# EAGLE design D-class (EAGLE 9.5.2)
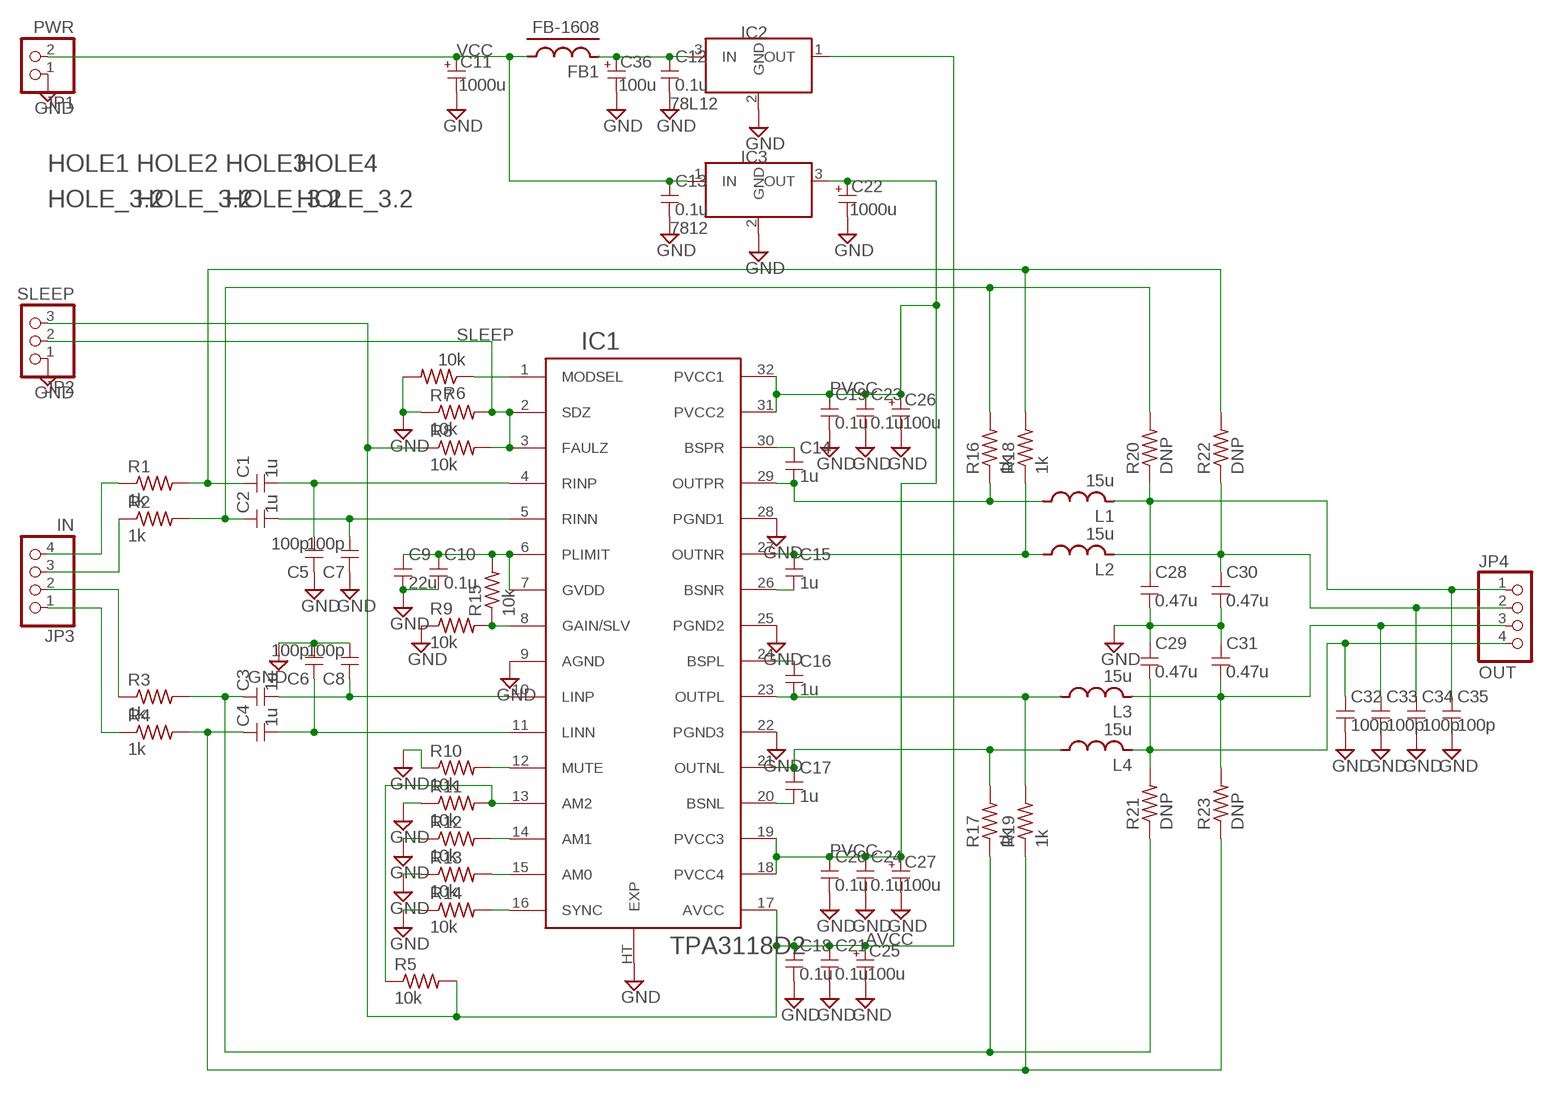
[diagram p0: schematic, sheet 1]

## Parts
C1  1u  C-3216  [3216]
C2  1u  C-3216  [3216]
C3  1u  C-3216  [3216]
C4  1u  C-3216  [3216]
C5  100p  C-1608  [1608]
C6  100p  C-1608  [1608]
C7  100p  C-1608  [1608]
C8  100p  C-1608  [1608]
C9  22u  C-2012  [2012]
C10  0.1u  C-1608  [1608]
C11  1000u  CPOLE5-10  [E5-10]
C12  0.1u  C-1608  [1608]
C13  0.1u  C-1608  [1608]
C14  1u  C-1608  [1608]
C15  1u  C-1608  [1608]
C16  1u  C-1608  [1608]
C17  1u  C-1608  [1608]
C18  0.1u  C-1608  [1608]
C19  0.1u  C-1608  [1608]
C20  0.1u  C-1608  [1608]
C21  0.1u  C-2012  [2012]
C22  1000u  CPOLE5-10  [E5-10]
C23  0.1u  C-2012  [2012]
C24  0.1u  C-2012  [2012]
C25  100u  CPOLE2.5-6.5  [E2.5-6.5]
C26  100u  CPOLE2.5-6.5  [E2.5-6.5]
C27  100u  CPOLE2.5-6.5  [E2.5-6.5]
C28  0.47u  C-5  [C050-030X075]
C29  0.47u  C-5  [C050-030X075]
C30  0.47u  C-5  [C050-030X075]
C31  0.47u  C-5  [C050-030X075]
C32  100p  C-1608  [1608]
C33  100p  C-1608  [1608]
C34  100p  C-1608  [1608]
C35  100p  C-1608  [1608]
C36  100u  CPOLE2.5-6.5  [E2.5-6.5]
FB1  FB-1608  [1608]
HOLE1  HOLE_3.2  [HOLE_3.2]
HOLE2  HOLE_3.2  [HOLE_3.2]
HOLE3  HOLE_3.2  [HOLE_3.2]
HOLE4  HOLE_3.2  [HOLE_3.2]
IC1  TPA3118D2  [HTSSOP32DAP]
IC2  78L12  78LX  [TO-92]
IC3  7812  78X-2  [TO-220]
JP1  PWR  PINHD-1X2  [1X02]
JP2  SLEEP  PINHD-1X3  [1X03]
JP3  IN  PINHD-1X4  [1X04]
JP4  OUT  PINHD-1X4  [1X04]
L1  15u  L-5  [L5-7,5]
L2  15u  L-5  [L5-7,5]
L3  15u  L-5  [L5-7,5]
L4  15u  L-5  [L5-7,5]
R1  1k  R-2.5  [0207/2V]
R2  1k  R-2.5  [0207/2V]
R3  1k  R-2.5  [0207/2V]
R4  1k  R-2.5  [0207/2V]
R5  10k  R-1608  [1608]
R6  10k  R-1608  [1608]
R7  10k  R-1608  [1608]
R8  10k  R-1608  [1608]
R9  10k  R-1608  [1608]
R10  10k  R-1608  [1608]
R11  10k  R-1608  [1608]
R12  10k  R-1608  [1608]
R13  10k  R-1608  [1608]
R14  10k  R-1608  [1608]
R15  10k  R-1608  [1608]
R16  1k  R-2.5  [0207/2V]
R17  1k  R-2.5  [0207/2V]
R18  1k  R-2.5  [0207/2V]
R19  1k  R-2.5  [0207/2V]
R20  DNP  R-2.5  [0207/2V]
R21  DNP  R-2.5  [0207/2V]
R22  DNP  R-2.5  [0207/2V]
R23  DNP  R-2.5  [0207/2V]

## Nets
AVCC: C18.1 C21.1 C25.+ IC1.17(AVCC) IC2.1(OUT) JP2.3 R5.2 R8.1
GND: C5.1 C6.2 C7.1 C8.2 C9.2 C10.2 C11.- C12.2 C13.2 C18.2 C19.2 C20.2 C21.2 C22.- C23.2 C24.2 C25.- C26.- C27.- C28.2 C29.1 C30.2 C31.1 C32.2 C33.2 C34.2 C35.2 C36.- IC1.9(AGND) IC1.22(PGND3) IC1.25(PGND2) IC1.28(PGND1) IC1.HT(EXP) IC2.2(GND) IC3.2(GND) JP1.1 JP2.1 R6.2 R7.1 R9.1 R10.1 R11.1 R12.1 R13.1 R14.1
N$1: C2.2 C7.2 IC1.5(RINN)
N$2: IC1.13(AM2) R5.1 R11.2
N$3: IC1.14(AM1) R12.2
N$4: IC1.15(AM0) R13.2
N$5: IC1.16(SYNC) R14.2
N$7: C12.1 C36.+ FB1.2 IC2.3(IN)
N$8: C17.2 IC1.20(BSNL)
N$9: C17.1 IC1.21(OUTNL) L4.P$1 R17.2
N$10: C16.2 IC1.23(OUTPL) L3.P$1 R19.2
N$11: C16.1 IC1.24(BSPL)
N$12: C15.2 IC1.26(BSNR)
N$13: C15.1 IC1.27(OUTNR) L2.P$1 R18.1
N$14: C14.2 IC1.29(OUTPR) L1.P$1 R16.1
N$15: C14.1 IC1.30(BSPR)
N$18: C3.2 C8.1 IC1.10(LINP)
N$19: C9.1 C10.1 IC1.6(PLIMIT) IC1.7(GVDD) R15.2
N$20: IC1.8(GAIN/SLV) R9.2 R15.1
N$21: C3.1 R3.2 R17.1 R21.1
N$22: C4.1 R4.2 R19.1 R23.1
N$23: C1.1 R1.2 R18.2 R22.2
N$24: C2.1 R2.2 R16.2 R20.2
N$25: C31.2 C33.1 JP4.3 L3.P$2 R23.2
N$26: C29.2 C32.1 JP4.4 L4.P$2 R21.2
N$27: C30.1 C34.1 JP4.2 L2.P$2 R22.1
N$28: C28.1 C35.1 JP4.1 L1.P$2 R20.1
N$29: JP3.2 R3.1
N$30: JP3.1 R4.1
N$31: JP3.3 R2.1
N$32: JP3.4 R1.1
N$36: IC1.1(MODSEL) R6.1
N$37: IC1.12(MUTE) R10.2
N$38: C1.2 C5.2 IC1.4(RINP)
N$39: C4.2 C6.1 IC1.11(LINN)
PVCC: C19.1 C20.1 C22.+ C23.1 C24.1 C26.+ C27.+ IC1.18(PVCC4) IC1.19(PVCC3) IC1.31(PVCC2) IC1.32(PVCC1) IC3.3(OUT)
SLEEP: IC1.2(SDZ) IC1.3(FAULZ) JP2.2 R7.2 R8.2
VCC: C11.+ C13.1 FB1.1 IC3.1(IN) JP1.2

## Library data of the parts
C1-C10 C12-C21 C23 C24 C28-C35 = my_rcl:C
C11 C22 C25-C27 C36 = my_rcl:CPOL
FB1 = my_rcl:FB
HOLE1-HOLE4 = Document_Robotech:HOLE_3.2: Robotech hole diameter 3.2mm tDoc washer(diameter 8mm) bDoc spacer(diameter 6mm)
IC1 = my_ic:TPA3118D2
IC2 = my_ic:78LX
IC3 = my_ic:78X
JP1 = pinhead:PINHD-1X2: PIN HEADER
JP2 = pinhead:PINHD-1X3: PIN HEADER
JP3 JP4 = pinhead:PINHD-1X4: PIN HEADER
L1-L4 = my_rcl:L
R1-R23 = my_rcl:R

## Board
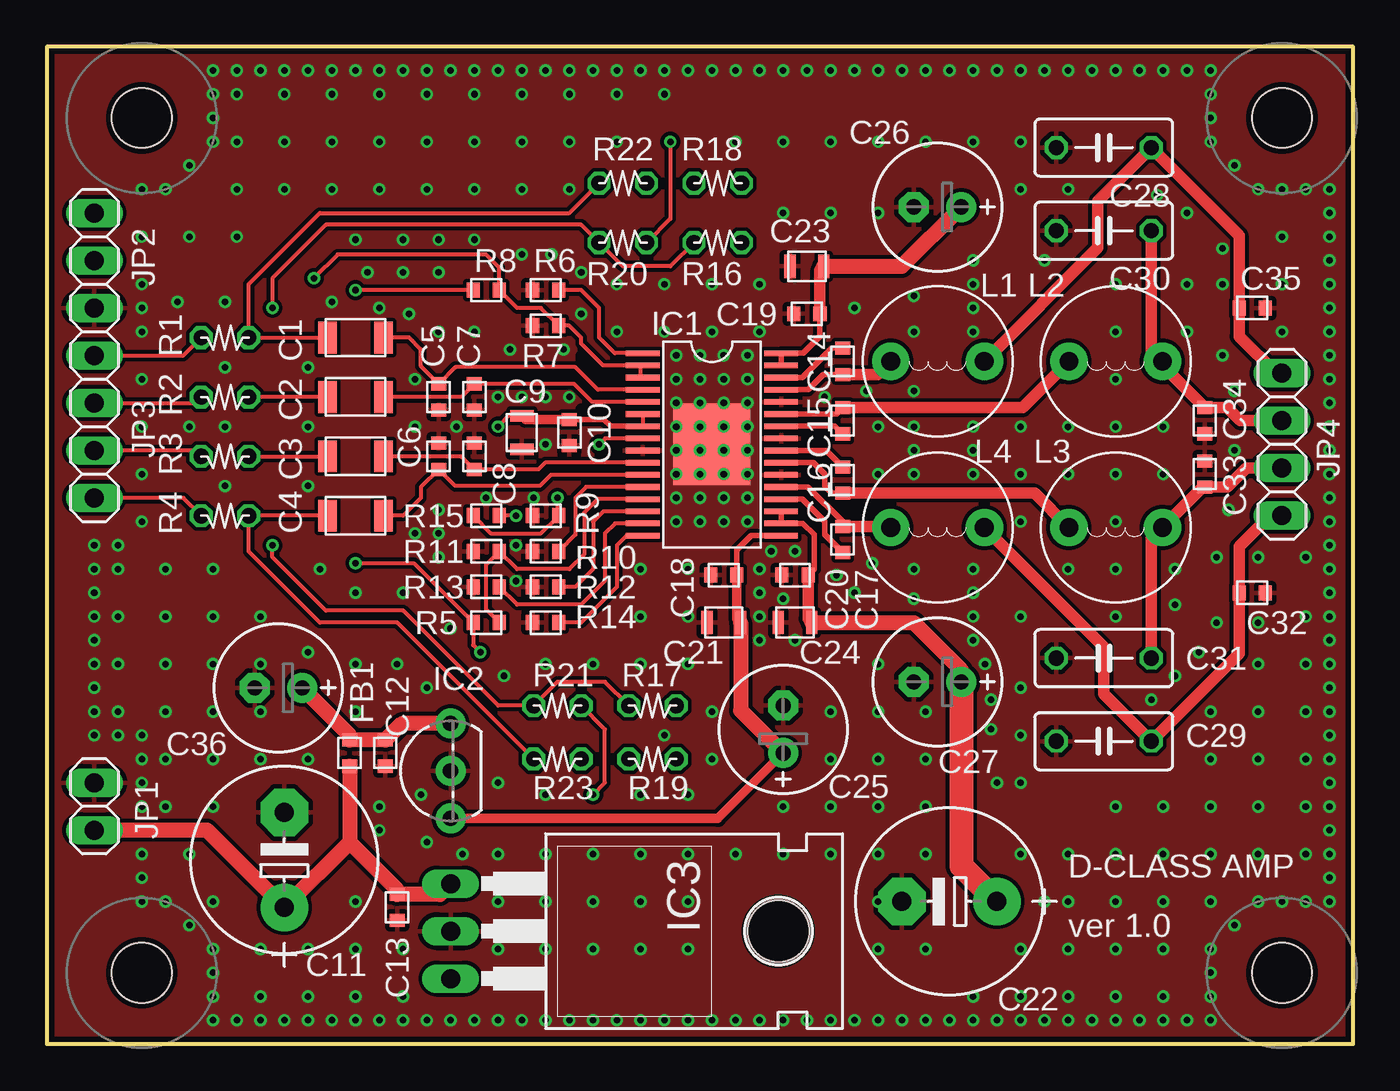
[diagram p1: board, top side]
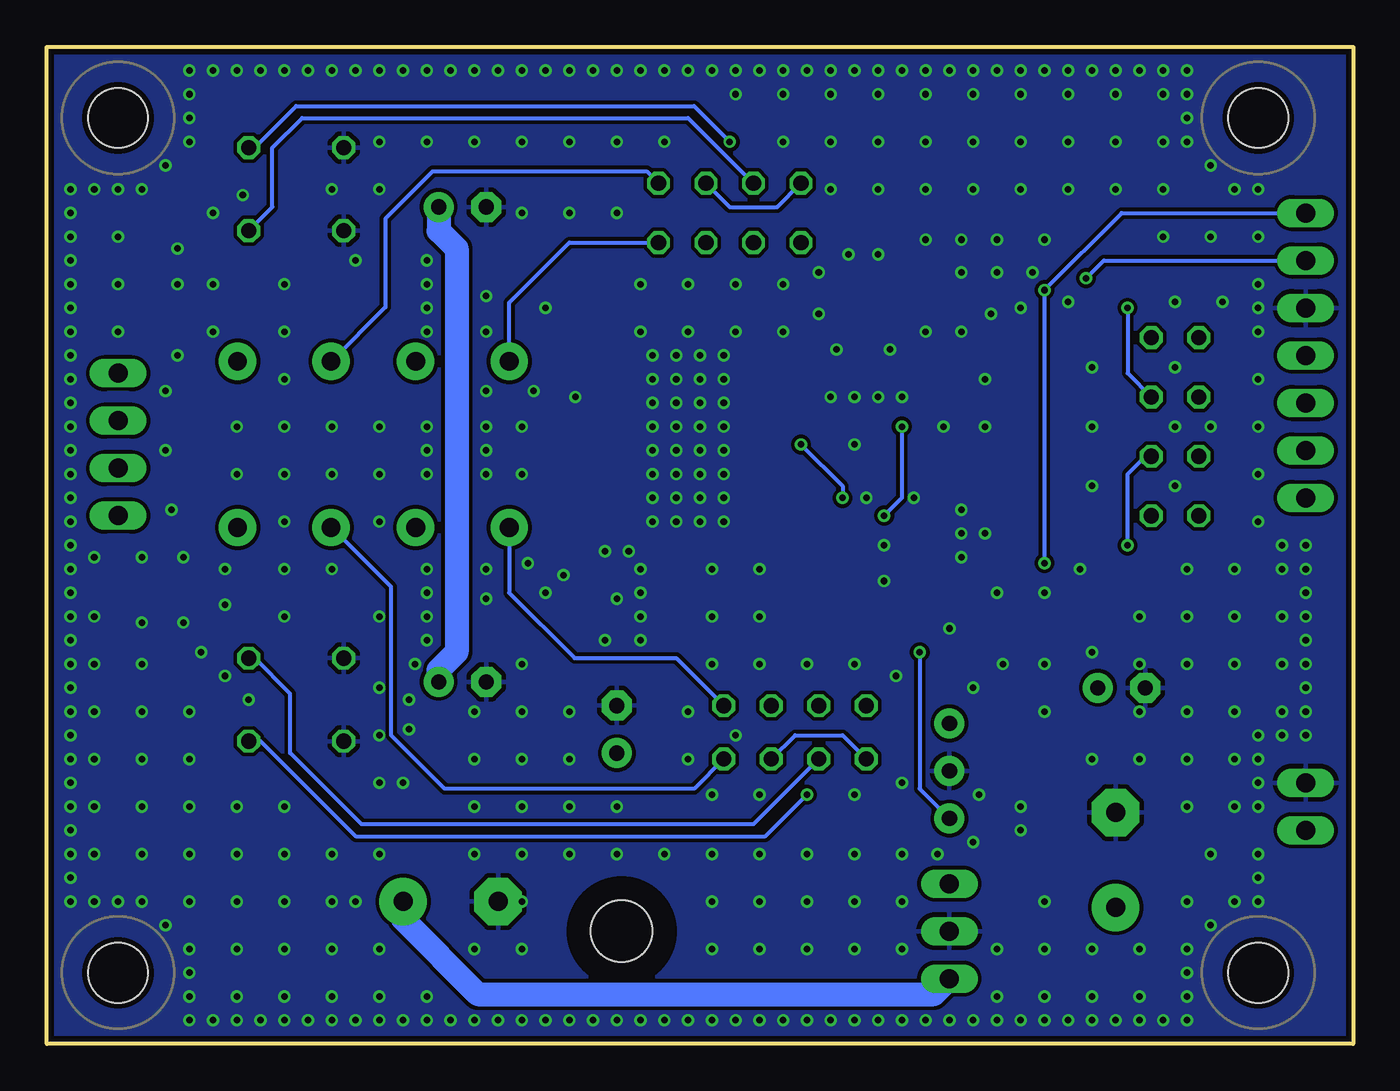
[diagram p2: board, bottom side, seen from below]

Size 69.85 x 53.34 mm. Coordinates in mm from the lower left corner, seen from the top.
Outline: 0,0 69.85,0 69.85,53.34 0,53.34 0,0
Copper layers (1*16): Top 0.035mm / dielectric 1.5mm / Bottom 0.035mm
Design rules "SeeedStudio_2layer_DRU_20140221": minimum track width 6mil, minimum drill 0.3mm, track to track 8mil, track to pad 8mil, pad to pad 8mil, via to via 12mil, smd to smd 0mil, copper to edge 0.3mm, drill to drill 10mil, minimum pad ring 0.15mm, minimum via ring 6mil, stop-mask expansion 2mil, vias tented up to drill 1mm, thermal gap 10mil
tRestrict: 5 lines

### Footprints (pad centres in the part's own frame; a part is rotated, then mirrored left to right if it is on the bottom)
3216 = smd 1 x 1.7: 1 -1.5,0; 2 1.5,0
1608 = smd 0.7 x 0.8: 1 -0.7,0; 2 0.7,0
2012 = smd 0.6 x 1.25: 1 -0.9,0; 2 0.9,0
E5-10 = drill 1.016 pad 2.54: + -2.54,0 | drill 1.016 pad 2.54 octagon: - 2.54,0
E2.5-6.5 = drill 0.813 pad 1.6: + -1.27,0 | drill 0.813 pad 1.6 octagon: - 1.27,0
C050-030X075 = drill 0.813 octagon: 1 -2.54,0; 2 2.54,0
HOLE_3.2 = hole 3.2: 0,0
HTSSOP32DAP = smd 0.3 x 1.8: 1 -4.875,-3.7; 2 -4.225,-3.7; 3 -3.575,-3.7; 4 -2.925,-3.7; 5 -2.275,-3.7; 6 -1.625,-3.7; 7 -0.975,-3.7; 8 -0.325,-3.7; 9 0.325,-3.7; 10 0.975,-3.7; 11 1.625,-3.7; 12 2.275,-3.7; 13 2.925,-3.7; 14 3.575,-3.7; 15 4.225,-3.7; 16 4.875,-3.7; 17 4.875,3.7; 18 4.225,3.7; 19 3.575,3.7; 20 2.925,3.7; 21 2.275,3.7; 22 1.625,3.7; 23 0.975,3.7; 24 0.325,3.7; 25 -0.325,3.7; 26 -0.975,3.7; 27 -1.625,3.7; 28 -2.275,3.7; 29 -2.925,3.7; 30 -3.575,3.7; 31 -4.225,3.7; 32 -4.875,3.7 | smd 4.36 x 4.11: HT 0,0
TO-92 = drill 0.813 pad 1.6: 1 -2.54,0; 2 0,0; 3 2.54,0
TO-220 = drill 1.016 long: 1 -2.54,-6.35; 2 0,-6.35; 3 2.54,-6.35 | hole 3.302: 0,11.176
1X02 = drill 1.016 long: 1 -1.27,0; 2 1.27,0
1X03 = drill 1.016 long: 1 -2.54,0; 2 0,0; 3 2.54,0
1X04 = drill 1.016 long: 1 -3.81,0; 2 -1.27,0; 3 1.27,0; 4 3.81,0
L5-7,5 = drill 1 pad 2: P$1 2.5,0; P$2 -2.5,0
0207/2V = drill 0.813 octagon: 1 -1.27,0; 2 1.27,0

### Placement (x,y rotation side)
C1  16.51,37.78 0 top
C2  16.51,34.61 0 top
C3  16.51,31.43 0 top
C4  16.51,28.26 0 top
C5  20.95,34.61 90 top
C6  20.95,31.43 90 top
C7  22.86,34.61 90 top
C8  22.86,31.43 90 top
C9  25.4,32.7 270 top
C10  27.94,32.7 270 top
C11  12.7,9.84 90 top
C12  18.1,15.56 270 top
C13  18.73,7.3 270 top
C14  42.55,36.51 270 top
C15  42.55,33.34 270 top
C16  42.55,30.16 270 top
C17  42.55,26.99 270 top
C18  36.2,25.08 180 top
C19  40.64,39.05 180 top
C20  40.01,25.08 180 top
C21  36.2,22.54 180 top
C22  48.26,7.62 180 top
C23  40.64,41.59 180 top
C24  40.01,22.54 180 top
C25  39.37,16.83 90 top
C26  47.62,44.77 180 top
C27  47.62,19.37 180 top
C28  56.52,47.94 180 top
C29  56.52,16.19 0 top
C30  56.52,43.5 180 top
C31  56.52,20.64 0 top
C32  64.45,24.13 0 top
C33  61.91,30.48 90 top
C34  61.91,33.34 270 top
C35  64.45,39.37 0 top
C36  12.38,19.05 180 top
FB1  16.19,15.56 90 top
HOLE1  5.08,3.81 0 top
HOLE2  66.04,3.81 0 top
HOLE3  66.04,49.53 0 top
HOLE4  5.08,49.53 0 top
IC1  35.56,32.07 270 top
IC2  21.59,14.61 90 top
IC3  27.94,6.03 270 top
JP1  2.54,12.7 270 top
JP2  2.54,41.91 90 top
JP3  2.54,33.02 90 top
JP4  66.04,32.07 270 top
L1  47.62,36.51 180 top
L2  57.15,36.51 180 top
L3  57.15,27.62 180 top
L4  47.62,27.62 180 top
R1  9.53,37.78 0 top
R2  9.53,34.61 0 top
R3  9.53,31.43 0 top
R4  9.53,28.26 0 top
R5  23.5,22.54 180 top
R6  26.67,40.32 180 top
R7  26.67,38.42 0 top
R8  23.5,40.32 0 top
R9  26.67,28.26 0 top
R10  26.67,26.35 0 top
R11  23.5,26.35 0 top
R12  26.67,24.45 0 top
R13  23.5,24.45 0 top
R14  26.67,22.54 0 top
R15  23.5,28.26 0 top
R16  35.88,42.86 180 top
R17  32.38,18.1 0 top
R18  35.88,46.04 180 top
R19  32.38,15.24 0 top
R20  30.8,42.86 180 top
R21  27.3,18.1 0 top
R22  30.8,46.04 180 top
R23  27.3,15.24 0 top

### Tracks (layer width: path | path; a pad name or v marks a point on that pad's centre or on a via)
AVCC  (via drill 0.35)
  Top 0.203: v23.18,20.95 22.8,21.34 R5.2 19.62,25.72 v16.51,25.72 | R8.1 v16.51,40.32
  Top 0.305: IC1.17 37.67,27.19 36.9,26.42 C18.1
  Top 0.508: C18.1 36.9,22.74 C21.1 | C25.+ 35.88,12.06 IC2.1
  Top 0.813: C21.1 37.09,17.83 C25.+
  Bottom 0.203: v16.51,25.72 v16.51,40.32 12.38,44.45 JP2.3 | IC2.1 23.18,13.65 v23.18,20.95
GND  (via drill 0.35)
  other vias: 2.54,25.4 2.54,24.13 2.54,22.86 2.54,21.59 2.54,20.32 2.54,19.05 2.54,17.78 2.54,16.51 2.54,26.67 3.81,16.51 5.08,16.51 5.08,15.24 5.08,13.97 5.08,12.7 5.08,10.16 5.08,8.89 13.97,1.27 15.24,1.27 16.51,1.27 17.78,1.27 19.05,1.27 20.32,1.27 21.59,1.27 22.86,1.27 24.13,1.27 25.4,1.27 26.67,1.27 27.94,1.27 29.21,1.27 30.48,1.27 31.75,1.27 33.02,1.27 34.29,1.27 35.56,1.27 36.83,1.27 38.1,1.27 39.37,1.27 40.64,1.27 41.91,1.27 43.18,1.27 44.45,1.27 45.72,1.27 46.99,1.27 48.26,1.27 49.53,1.27 50.8,1.27 52.07,1.27 53.34,1.27 54.61,1.27 55.88,1.27 57.15,1.27 58.42,1.27 59.69,1.27 60.96,1.27 62.23,2.54 62.23,3.81 62.23,5.08 63.5,6.35 64.77,7.62 66.04,7.62 67.31,7.62 68.58,7.62 68.58,8.89 68.58,10.16 68.58,11.43 68.58,12.7 68.58,13.97 68.58,15.24 68.58,16.51 68.58,17.78 68.58,19.05 68.58,20.32 68.58,21.59 68.58,22.86 68.58,24.13 68.58,25.4 68.58,26.67 68.58,27.94 68.58,29.21 68.58,30.48 68.58,31.75 68.58,33.02 68.58,34.29 68.58,35.56 68.58,36.83 68.58,38.1 68.58,39.37 68.58,40.64 68.58,41.91 68.58,43.18 68.58,44.45 68.58,45.72 67.31,45.72 64.77,45.72 63.5,46.99 62.23,48.26 62.23,49.53 62.23,50.8 62.23,52.07 60.96,52.07 59.69,52.07 58.42,52.07 57.15,52.07 55.88,52.07 54.61,52.07 53.34,52.07 52.07,52.07 50.8,52.07 49.53,52.07 48.26,52.07 46.99,52.07 45.72,52.07 44.45,52.07 43.18,52.07 41.91,52.07 40.64,52.07 39.37,52.07 38.1,52.07 36.83,52.07 35.56,52.07 34.29,52.07 33.02,52.07 31.75,52.07 30.48,52.07 29.21,52.07 27.94,52.07 26.67,52.07 25.4,52.07 24.13,52.07 22.86,52.07 21.59,52.07 20.32,52.07 19.05,52.07 17.78,52.07 16.51,52.07 15.24,52.07 13.97,52.07 12.7,52.07 11.43,52.07 10.16,52.07 8.89,52.07 8.89,50.8 8.89,49.53 8.89,48.26 7.62,46.99 6.35,45.72 5.08,45.72 5.08,43.18 5.08,40.64 5.08,39.37 5.08,38.1 5.08,35.56 5.08,33.02 5.08,30.48 5.08,27.94 3.81,26.67 5.08,7.62 6.35,7.62 7.62,6.35 8.89,5.08 8.89,3.81 8.89,2.54 8.89,1.27 10.16,1.27 11.43,1.27 12.7,1.27 62.23,1.27 66.04,45.72 26.04,29.21 23.5,29.21 20.95,28.57 20.95,27.3 20.95,26.04 19.68,27.3 26.67,32.07 27.94,34.61 26.67,34.61 25.4,34.61 24.13,34.61 21.91,33.02 19.68,33.02 27.62,37.15 28.57,39.05 25.08,24.77 33.66,36.83 34.92,36.83 36.2,36.83 37.47,36.83 37.47,35.56 36.2,35.56 34.92,35.56 33.66,35.56 33.66,34.29 34.92,34.29 36.2,34.29 37.47,34.29 37.47,33.02 36.2,33.02 34.92,33.02 33.66,33.02 33.66,31.75 34.92,31.75 36.2,31.75 37.47,31.75 37.47,30.48 36.2,30.48 34.92,30.48 33.66,30.48 33.66,29.21 34.92,29.21 36.2,29.21 37.47,29.21 37.47,27.94 36.2,27.94 34.92,27.94 33.66,27.94 44.45,33.02 44.45,30.48 46.35,30.48 46.35,33.02 49.53,33.02 49.53,30.48 52.07,33.02 52.07,30.48 54.61,33.02 54.61,30.48 57.15,33.02 57.15,30.48 57.15,27.94 59.69,30.48 59.69,33.02 57.15,35.56 57.15,25.4 60.33,25.4 60.33,23.5 57.15,22.86 54.61,25.4 52.07,27.94 49.53,25.4 52.07,22.86 49.53,22.86 46.35,25.4 46.35,23.81 44.13,25.72 43.18,24.13 42.23,25.08 40.01,26.35 38.73,26.35 38.1,25.4 38.1,24.13 38.1,22.86 38.1,21.59 39.37,23.81 40.01,21.59 34.29,25.4 31.75,25.4 31.75,22.86 34.29,22.86 34.29,20.32 31.75,20.32 29.21,20.32 26.67,20.32 35.56,17.78 35.56,15.24 33.02,16.51 24.45,19.68 44.45,20.32 44.45,17.78 41.91,17.78 46.99,17.78 44.45,15.24 41.91,15.24 44.45,12.7 41.91,12.7 39.37,12.7 46.99,12.7 41.91,10.16 44.45,10.16 39.37,10.16 36.83,10.16 34.29,10.16 34.29,13.34 31.75,13.34 31.75,10.16 29.21,10.16 26.67,10.16 24.13,10.16 24.13,7.62 26.67,7.62 29.21,7.62 31.75,7.62 34.29,7.62 44.45,7.62 44.45,5.08 46.99,5.08 34.29,5.08 31.75,5.08 29.21,5.08 26.67,5.08 24.13,5.08 64.77,26.04 64.77,22.54 67.31,26.04 67.31,22.86 64.77,20.32 67.31,20.32 67.31,17.78 67.31,15.24 64.77,17.78 64.77,15.24 64.77,12.7 67.31,12.7 67.31,10.16 64.77,10.16 62.23,15.24 62.23,12.7 62.23,10.16 59.69,12.7 59.69,10.16 59.69,7.62 62.23,7.62 57.15,12.7 57.15,10.16 57.15,7.62 59.69,5.08 59.69,2.54 57.15,2.54 57.15,5.08 54.61,2.54 54.61,5.08 54.61,7.62 54.61,10.16 52.07,10.16 53.34,7.62 52.07,5.08 52.07,2.54 49.53,2.54 19.05,5.08 16.51,5.08 19.05,2.54 16.51,2.54 13.97,2.54 11.43,2.54 11.43,5.08 13.97,5.08 16.51,7.62 8.89,7.62 7.62,10.16 8.89,12.7 8.89,15.24 11.43,15.24 13.97,15.24 11.43,17.78 6.35,15.24 6.35,12.7 6.35,17.78 8.89,17.78 3.81,17.78 3.81,20.32 6.35,20.32 8.89,20.32 11.43,20.32 13.97,20.95 16.51,20.32 3.81,22.86 6.35,22.86 8.89,22.86 11.43,22.86 3.81,25.4 6.35,25.4 8.89,25.4 16.51,24.13 19.05,24.13 18.73,20.32 21.59,22.23 9.53,29.84 9.53,33.02 7.62,33.02 9.53,36.2 9.53,39.69 6.99,39.69 57.15,38.1 57.15,40.64 60.96,38.1 60.96,40.64 66.04,40.64 66.04,38.1 66.04,43.18 49.53,39.37 49.53,41.91 46.35,40.01 43.18,39.37 44.45,44.45 41.91,44.45 39.37,44.45 39.37,48.26 41.91,48.26 44.45,48.26 46.99,48.26 49.53,48.26 52.07,48.26 52.07,45.72 54.61,45.72 53.34,41.91 38.1,40.64 38.1,38.1 35.56,38.1 35.56,40.64 33.02,40.64 33.02,38.1 30.48,38.1 30.48,40.64 28.57,41.27 26.99,42.23 25.4,42.23 24.77,37.15 22.86,38.1 20.95,38.1 19.37,39.05 17.78,39.37 15.24,39.69 19.68,35.56 13.97,36.2 13.97,33.02 13.97,29.84 14.61,25.4 7.62,43.18 10.16,43.18 10.16,45.72 12.7,45.72 10.16,48.26 10.16,50.8 12.7,50.8 12.7,48.26 15.24,50.8 15.24,48.26 15.24,45.72 17.78,45.72 17.78,48.26 17.78,50.8 20.32,50.8 20.32,48.26 20.32,45.72 22.86,45.72 22.86,48.26 22.86,50.8 25.4,50.8 25.4,48.26 25.4,45.72 27.94,45.72 27.94,48.26 27.94,50.8 30.48,50.8 30.48,48.26 33.02,50.8 36.83,48.26 52.07,19.05 52.07,16.51 52.07,13.97 63.5,31.75 63.5,34.92 62.87,36.83 62.87,40.64 62.87,42.55 60.96,44.45 59.37,45.4 63.18,28.57 62.55,26.04 62.55,22.54 61.59,20.95 60.33,19.68 59.05,18.41 62.23,17.78 25.08,26.67 20.95,41.27 19.05,41.27 16.51,43.02 19.05,43.02 20.95,43.02 22.86,43.02 17.14,41.27 43.81,34.92 46.35,34.92 41.59,34.61 46.99,10.16 46.99,15.24 50.48,16.83 50.48,18.41 50.16,20.32 50.8,13.97 46.35,31.75 49.53,31.75 46.35,38.1 49.53,38.1 49.53,40.64 49.53,24.13 49.53,21.59 17.78,11.43 20,13.34 20.32,10.79 22.23,10.16 24.13,13.97 26.67,13.34 16.51,17.78 17.78,12.7 20.32,19.05
  pour Bottom (isolate 0.203): 0,53.34 0,0 69.85,0 69.85,53.34
  pour Top (isolate 0.203): 0,53.34 0,0 69.85,0 69.85,53.34
  pour Top (isolate 0.203, no thermals): 33.02,35.24 33.02,28.89 38.1,28.89 38.1,35.24
N$1
  Top 0.203: IC1.5 29.16,34.34 28.19,35.31 C7.2 22.16,34.61 C2.2
N$2
  Top 0.203: IC1.13 29.46,29.14 28.73,28.42 28.73,26.19 27.94,25.4 25.15,25.4 R11.2 23.5,25.65 23.5,23.24 R5.1
N$3
  Top 0.203: R12.2 28.26,24.45 29.21,25.4 29.21,27.94 29.76,28.49 IC1.14
N$4
  Top 0.203: IC1.15 30.38,27.84 29.84,27.3 29.84,24.77 28.57,23.5 25.15,23.5 R13.2
N$5
  Top 0.203: IC1.16 31,27.19 30.48,26.67 30.48,24.45 28.57,22.54 R14.2
N$7
  Top 0.813: IC2.3 18.98,17.14 C12.1 FB1.2 16.19,16.51 C36.+
N$8
  Top 0.305: IC1.20 40.39,29.14 41.59,27.94 41.59,27.24 C17.2
N$9
  Top 0.305: IC1.21 40.69,29.79 42.55,27.94 C17.1
  Top 0.61: C17.1 45.06,27.69 L4.P$1
  Bottom 0.203: R17.2 36.2,20.64 41.63,20.64 45.12,24.13 L4.P$1
N$10
  Top 0.305: C16.2 41.98,29.46 41.59,29.84 41.59,30.48 40.98,31.09 IC1.23
  Top 0.61: C16.2 52.81,29.46 L3.P$1
  Bottom 0.203: R19.2 35.24,13.65 48.58,13.65 51.44,16.51 51.44,24.45 54.61,27.62 L3.P$1
N$11
  Top 0.305: IC1.24 41.66,31.74 C16.1
N$12
  Top 0.305: IC1.26 42.14,33.04 C15.2
N$13
  Top 0.305: IC1.27 42.2,33.69 C15.1
  Top 0.61: C15.1 52.17,34.04 L2.P$1
  Bottom 0.203: R18.1 37.78,46.67 49.21,46.67 51.75,44.13 51.75,39.41 L2.P$1
N$14
  Top 0.305: IC1.29 40.71,34.99 41.53,35.81 C14.2
  Top 0.61: C14.2 44.42,35.81 L1.P$1
  Bottom 0.203: L1.P$1 45.12,39.65 41.91,42.86 R16.1
N$15
  Top 0.305: IC1.30 40.41,35.64 41.98,37.21 C14.1
N$18
  Top 0.203: IC1.10 26.65,31.09 26.29,30.73 C8.1 22.16,31.43 C3.2
N$19  (via drill 0.35)
  Top 0.203: IC1.6 IC1.7 | C9.1 24.71,33.6 v24.13,33.02 | v25.08,28.26 R15.2
  Top 0.305: IC1.7 30.14,33.04 29.78,33.4 C10.1
  Top 0.508: C10.1 25.6,33.4 C9.1
  Bottom 0.203: v25.08,28.26 24.13,29.21 v24.13,33.02
N$20  (via drill 0.35)
  Top 0.203: IC1.8 29.85,32.39 v29.53,32.07 | R15.1 23.75,27.3 26.42,27.3 27.34,28.23 | 27.34,28.23 R9.2 | v27.3,29.21 27.3,28.26 27.34,28.23
  Bottom 0.203: v29.53,32.07 27.3,29.84 v27.3,29.21
N$21  (via drill 0.35)
  Top 0.203: R3.2 C3.1 | v12.06,26.67 12.06,26.04 14.92,23.18 19.05,23.18 24.13,18.1 R21.1 27.3,19.37 29.84,19.37 R17.1
  Bottom 0.203: v12.06,26.67 12.06,30.48 11.11,31.43 R3.2
N$22
  Top 0.203: C4.1 R4.2 10.79,26.35 14.61,22.54 18.73,22.54 R23.1
  Bottom 0.203: R19.1 29.84,16.51 27.3,16.51 R23.1
N$23
  Top 0.203: C1.1 R1.2 10.79,40.64 14.61,44.45 27.94,44.45 R22.2
  Bottom 0.203: R18.2 33.34,44.77 30.8,44.77 R22.2
N$24  (via drill 0.35)
  Top 0.203: C2.1 R2.2 | R16.2 33.34,41.59 30.8,41.59 R20.2 28.57,43.81 14.92,43.81 12.06,40.96 v12.06,39.37
  Bottom 0.203: v12.06,39.37 12.06,35.88 R2.2
N$25
  Top 0.61: C31.2 59.05,27.03 L3.P$2 61.81,29.78 C33.1 63.12,29.78 64.14,30.8 JP4.3
  Bottom 0.203: R23.2 32.07,11.75 53.02,11.75 56.83,15.56 56.83,18.73 58.74,20.64 C31.2
N$26  (via drill 0.35)
  Top 0.203: v29.21,13.34 29.84,13.97 29.84,16.83 R21.2
  Top 0.61: L4.P$2 56.52,21.23 56.52,18.73 C29.2 63.75,20.89 C32.1 63.75,26.61 65.41,28.26 JP4.4
  Bottom 0.203: C29.2 58.42,16.19 53.34,11.11 31.43,11.11 v29.21,13.34
N$27
  Top 0.61: L2.P$2 59.51,36.65 | 59.51,36.65 59.05,37.11 C30.1 | JP4.2 63.82,33.34 63.12,34.04 C34.1 59.51,36.44 59.51,36.65
  Bottom 0.203: C30.1 57.78,44.77 57.78,47.94 56.2,49.53 35.56,49.53 R22.1
N$28  (via drill 0.35)
  Top 0.203: v33.34,48.26 33.34,44.13 R20.1
  Top 0.61: L1.P$2 56.2,42.59 56.2,45.09 C28.1 63.75,43.24 C35.1 63.75,37.85 65.72,35.88 JP4.1
  Bottom 0.203: C28.1 58.74,47.94 56.52,50.16 35.24,50.16 v33.34,48.26
N$29
  Top 0.203: R3.1 7.94,31.75 JP3.2
N$30
  Top 0.203: R4.1 7.3,29.21 JP3.1
N$31
  Top 0.203: JP3.3 7.94,34.29 R2.1
N$32
  Top 0.203: JP3.4 7.3,36.83 R1.1
N$36
  Top 0.203: IC1.1 30.37,36.94 29.53,37.78 29.53,39.37 28.57,40.32 R6.1
N$37
  Top 0.203: R10.2 28.26,27.24 28.26,29.21 28.84,29.79 IC1.12
N$38
  Top 0.203: IC1.4 29.46,34.99 28.26,36.2 21.84,36.2 C5.2 20,36.26 20,37.15 19.37,37.78 C1.2
N$39
  Top 0.203: IC1.11 26.95,30.44 26.35,29.84 21.84,29.84 C6.1 20,29.78 20,29.21 19.05,28.26 C4.2
PVCC
  Top 0.305: IC1.31 IC1.32 40.44,36.94 41.34,37.85 C19.1 | IC1.19 IC1.18 40.42,27.84 41.02,27.24 41.02,25.4 C20.1
  Top 0.61: C20.1 40.7,22.74 C24.1 | C19.1 41.34,41.39 C23.1
  Top 0.813: C23.1 45.72,41.59 C26.+ | C24.1 46.35,22.54 48.9,20 C27.+
  Top 1.27: C27.+ 48.9,9.53 C22.+
  Bottom 1.27: C26.+ 48.9,43.5 47.94,42.55 47.94,20.95 48.9,20 C27.+ | C22.+ 50.8,6.67 46.79,2.66 22.42,2.66 IC3.3
SLEEP  (via drill 0.35)
  Top 0.203: IC1.2 31.75,36.29 | 31.75,36.29 29.75,36.29 28.57,37.47 28.57,37.78 27.94,38.42 R7.2 26.42,39.37 25.15,39.37 R8.2 24.2,41.53 23.5,42.23 15.56,42.23 v14.29,40.96 | IC1.3 31.75,35.75 31.75,36.29
  Bottom 0.203: v14.29,40.96 13.34,41.91 JP2.2
VCC
  Top 0.813: IC3.1 21.02,8 C13.1 18.73,8.26 16.19,10.79 | JP1.2 8.57,11.43 C11.+ 16.19,10.79 | FB1.1 16.19,10.79

### Text on the board
tPlace: D-CLASS AMP | ver 1.0